# EAGLE design mainboard (EAGLE 9.6.2)
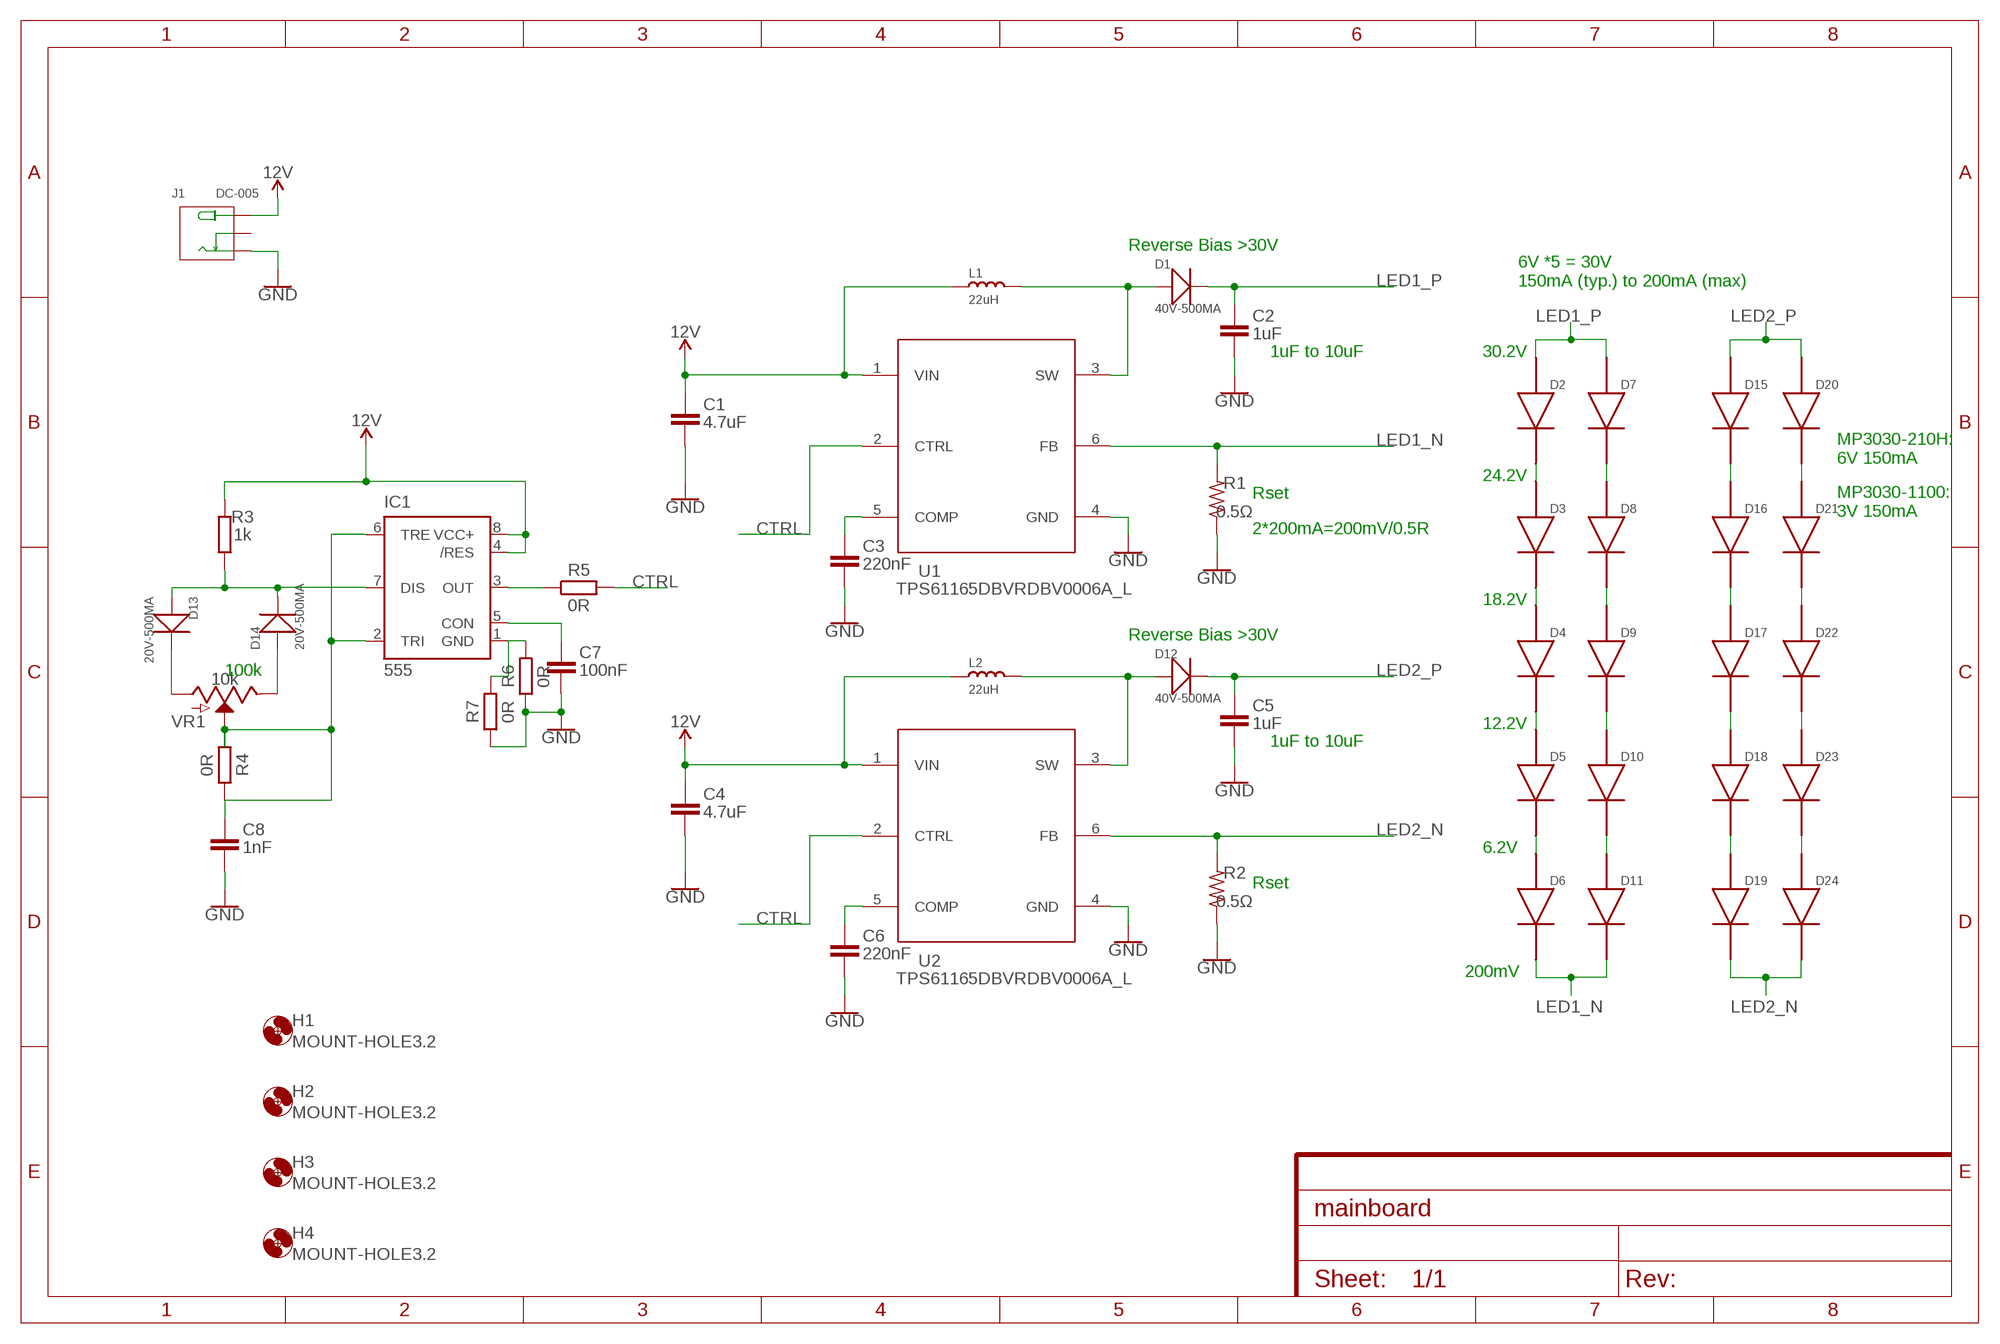
[diagram p0: schematic, sheet 1]

## Parts
C1  4.7uF  C_CHIP-0805(2012-METRIC)  [CAPC2012X110]
C2  1uF  C_CHIP-0805(2012-METRIC)  [CAPC2012X110]
C3  220nF  C_CHIP-0603(1608-METRIC)  [CAPC1608X85]
C4  4.7uF  C_CHIP-0805(2012-METRIC)  [CAPC2012X110]
C5  1uF  C_CHIP-0805(2012-METRIC)  [CAPC2012X110]
C6  220nF  C_CHIP-0603(1608-METRIC)  [CAPC1608X85]
C7  100nF  C_CHIP-0603(1608-METRIC)  [CAPC1608X85]
C8  1nF  C_CHIP-0603(1608-METRIC)  [CAPC1608X85]
D1  40V-500MA  SMD-DIODE-SCHOTTKY-40V-500MA(SOD-123)  [SOD-123]
D2  MP3030_N  [MP3030_N]
D3  MP3030_N  [MP3030_N]
D4  MP3030_N  [MP3030_N]
D5  MP3030_N  [MP3030_N]
D6  MP3030_N  [MP3030_N]
D7  MP3030_N  [MP3030_N]
D8  MP3030_N  [MP3030_N]
D9  MP3030_N  [MP3030_N]
D10  MP3030_N  [MP3030_N]
D11  MP3030_N  [MP3030_N]
D12  40V-500MA  SMD-DIODE-SCHOTTKY-40V-500MA(SOD-123)  [SOD-123]
D13  20V-500MA  SMD-DIODE-SCHOTTKY-20V-500MA(SOD-123)  [SOD-123]
D14  20V-500MA  SMD-DIODE-SCHOTTKY-20V-500MA(SOD-123)  [SOD-123]
D15  MP3030_N  [MP3030_N]
D16  MP3030_N  [MP3030_N]
D17  MP3030_N  [MP3030_N]
D18  MP3030_N  [MP3030_N]
D19  MP3030_N  [MP3030_N]
D20  MP3030_N  [MP3030_N]
D21  MP3030_N  [MP3030_N]
D22  MP3030_N  [MP3030_N]
D23  MP3030_N  [MP3030_N]
D24  MP3030_N  [MP3030_N]
H1  MOUNT-HOLE3.2  [3,2]
H2  MOUNT-HOLE3.2  [3,2]
H3  MOUNT-HOLE3.2  [3,2]
H4  MOUNT-HOLE3.2  [3,2]
IC1  555  555D  [SO08]
J1  DC-005  CONN-POWER-JACK-2.1MM(DC-005)  [DCJ3P-14.2X11.0X9.0MM]
L1  22uH  SMD-INDUCTOR-10UH-20%(2P-6X6MM)'0630'  [SMD-2P-L6.0XW6.0XH3.0MM]
L2  22uH  SMD-INDUCTOR-10UH-20%(2P-6X6MM)'0630'  [SMD-2P-L6.0XW6.0XH3.0MM]
R1  0.5Ω  R-US_CHIP-1206(3216-METRIC)  [RESC3216X70]
R2  0.5Ω  R-US_CHIP-1206(3216-METRIC)  [RESC3216X70]
R3  1k  R_CHIP-0603(1608-METRIC)  [RESC1608X60]
R4  0R  R_CHIP-0603(1608-METRIC)  [RESC1608X60]
R5  0R  R_CHIP-0603(1608-METRIC)  [RESC1608X60]
R6  0R  R_CHIP-1206(3216-METRIC)  [RESC3216X70]
R7  0R  R_CHIP-1206(3216-METRIC)  [RESC3216X70]
U1  TPS61165DBVRDBV0006A_L  [DBV0006A_L]
U2  TPS61165DBVRDBV0006A_L  [DBV0006A_L]
VR1  10k  POTENTIOMETER-PTH-9MM-1/20W-20%  [POT-PTH-ALPS]

## Nets
12V: C1.1 C4.1 IC1.4(/RES) IC1.8(VCC+) J1.+B(+) J1.+T(+) L1.1 L2.1 R3.2 U1.1(VIN) U2.1(VIN)
COMP: C3.1 U1.5(COMP)
COMP1: C6.1 U2.5(COMP)
CON: C7.1 IC1.5(CON)
CTRL: R5.2 U1.2(CTRL) U2.2(CTRL)
DISCHARGE: D13.+ D14.- IC1.7(DIS) R3.1
GND: C1.2 C2.2 C3.2 C4.2 C5.2 C6.2 C7.2 C8.2 IC1.1(GND) J1.-1B(-) J1.-1T(-) R1.1 R2.1 R6.1 R6.2 R7.1 R7.2 U1.4(GND) U2.4(GND)
LED1_N: D6.2 D11.2 R1.2 U1.6(FB)
LED1_P: C2.1 D1.- D2.1 D7.1
LED2_N: D19.2 D24.2 R2.2 U2.6(FB)
LED2_P: C5.1 D12.- D15.1 D20.1
N$1: D17.2 D18.1
N$2: D2.2 D3.1
N$3: D7.2 D8.1
N$4: D3.2 D4.1
N$5: D8.2 D9.1
N$6: D4.2 D5.1
N$7: D9.2 D10.1
N$8: D5.2 D6.1
N$9: D13.- VR1.P$3(A)
N$10: D14.+ VR1.P$1(E)
N$11: D10.2 D11.1
N$12: IC1.3(OUT) R5.1
N$13: D15.2 D16.1
N$15: D16.2 D17.1
N$17: D18.2 D19.1
N$18: D23.2 D24.1
N$19: D22.2 D23.1
N$20: D21.2 D22.1
N$21: D20.2 D21.1
SW: D1.+ L1.2 U1.3(SW)
SW1: D12.+ L2.2 U2.3(SW)
TRIGGER: C8.1 IC1.2(TRI) IC1.6(TRE) R4.1 R4.2 VR1.P$2(S)
Unconnected: J1.-2(CDN) J1.-2B(CDN)

## Notes on the sheet
- Reverse Bias >30V
- 6V *5 = 30V
  150mA (typ.) to 200mA (max)
- 1uF to 10uF | 30.2V
- MP3030-210H:
  6V 150mA
- 24.2V
- Rset
- MP3030-1100:
  3V 150mA
- 2*200mA=200mV/0.5R
- 18.2V
- Reverse Bias >30V
- 100k
- 12.2V
- 1uF to 10uF
- 6.2V
- Rset
- 200mV

## Library data of the parts
C1-C8 = Capacitor:C: Capacitor - Generic; CATEGORY: Capacitor
D1 D12 = OPL_Discrete_Semiconductor:SMD-DIODE-SCHOTTKY-40V-500MA(SOD-123): 304020012; MPN: B0540W
D2-D11 D15-D24 = MP3030:MP3030_N: MP3030 Mid Power LED
D13 D14 = OPL_Discrete_Semiconductor:SMD-DIODE-SCHOTTKY-20V-500MA(SOD-123): 304020032; MPN: SS0520-7-F
H1-H4 = holes:MOUNT-HOLE: MOUNTING HOLE with drill center marker
IC1 = SparkFun-IC-Special-Function:555: General purpose bipolar Timer Datasheet <http://www.sparkfun.com/datasheets/Components/General/ne555.pdf> SparkFun Products SparkFun SparkPunk Sequencer Kit <https://www.sparkfun.com/products/12707> (KIT-12707) Storefront Component: 555 Timer <https://www.sparkfun.com/products/9273> (COM-09273) Two parts valid for production: VFP: IC-11930 (M7555 PTH) VFP: IC-09173 (555 PTH) - Preferred; PROD_ID: NA-XXXXX
J1 = OPL_Connector:CONN-POWER-JACK-2.1MM(DC-005): Seeed SKU 320120003 - DIP Black DC Jack 2.1MM MPN: DC-005 Important Notes: This part requires milling slots. Please make sure layer 46 Milling is included in the profile or outline layer when exporting Gerber files. Alternatively, you can use the built-in Seeed Fusion CAM file. Find it under Third-Party CAM files. Seeed Fusion PCBA OPL <https://www.seeedstudio.com/opl.html> Order PCB/PCBA Now <https://www.seeedstudio.com/fusion_pcb.html> www.seeedstudio.com; MPN: DC-005
L1 L2 = OPL_Inductor:SMD-INDUCTOR-10UH-20%(2P-6X6MM): 303010016; MPN: CSAB0630-100M; VALUE: 10UH
R1 R2 = Resistor:R-US: Resistor Fixed - ANSI; CATEGORY: Resistor; SUB-CATEGORY: Fixed
R3-R7 = Resistor:R: Resistor Fixed - Generic; CATEGORY: Resistor; SUB-CATEGORY: Fixed
U1 U2 = MP3030:TPS61165DBVR; COPYRIGHT: Copyright (C) 2021 Ultra Librarian. All rights reserved.; MANUFACTURER_PART_NUMBER: TPS61165DBVR; MFR_NAME: Texas Instruments; REFDES: RefDes; TYPE: TYPE
VR1 = SparkFun-Resistors:POTENTIOMETER: Potentiometer (Pot) Three-terminal potentiometers, with an adjustable wiper and two adjustable resistors. A pot can be used to create a configurable voltage divider, or as a variable resistor. Variants ALPS_POT and ALPS_POT_KIT - PTH, breadboard compatible, 9mm square pots Rotary Potentiometer - Linear (10k ohm) <https://www.sparkfun.com/products/9288> (COM-09288) The KIT variant exposes copper on only one side of the PTH pad, so the part can only be assembled on one side of the PCB. Useful for beginner soldering kits.; PROD_ID: RES-09177; SF_SKU: COM-09288

## Board
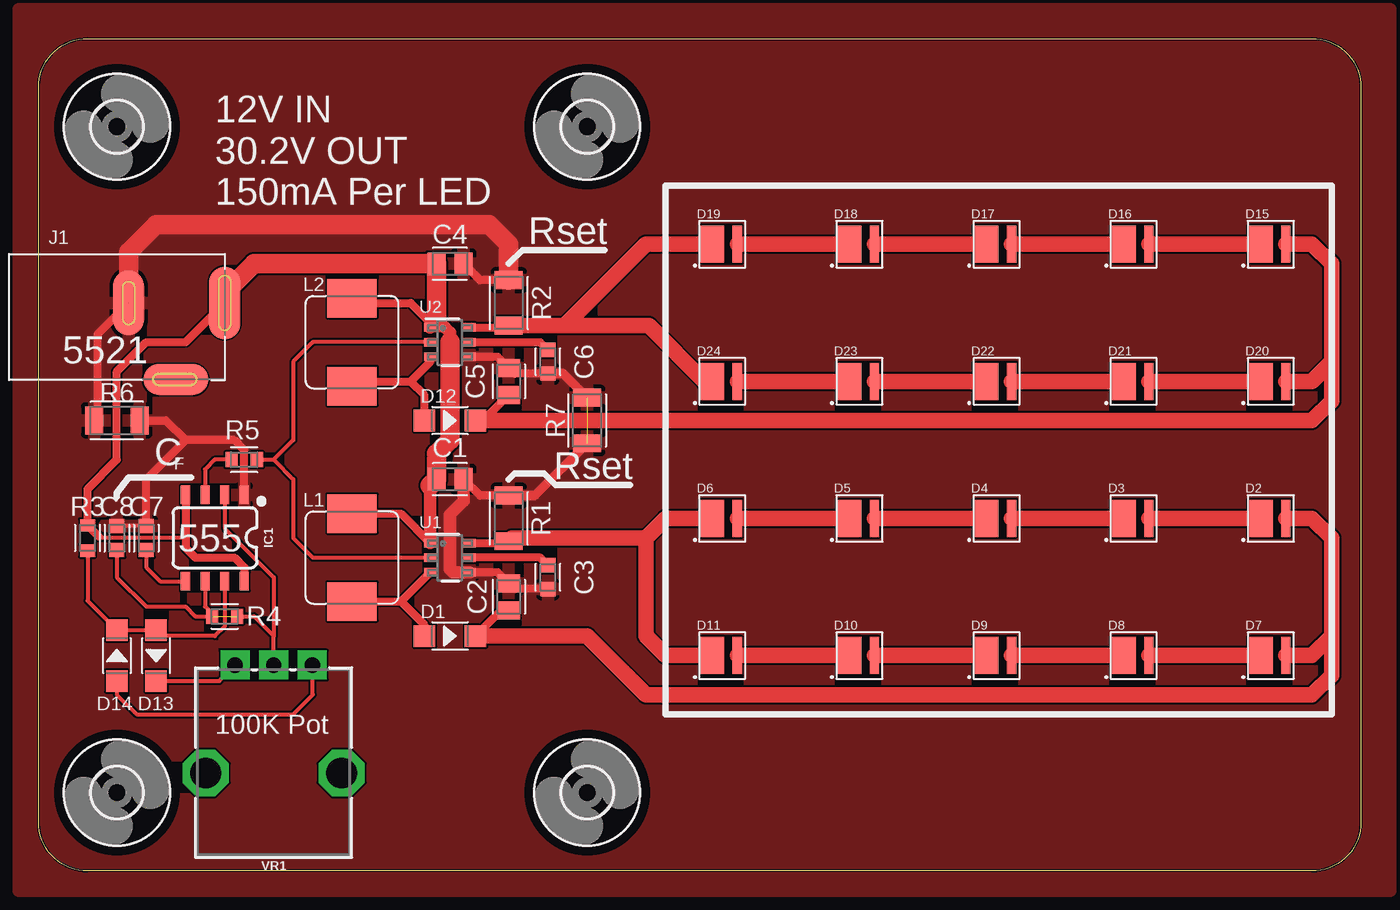
[diagram p1: board, top side]
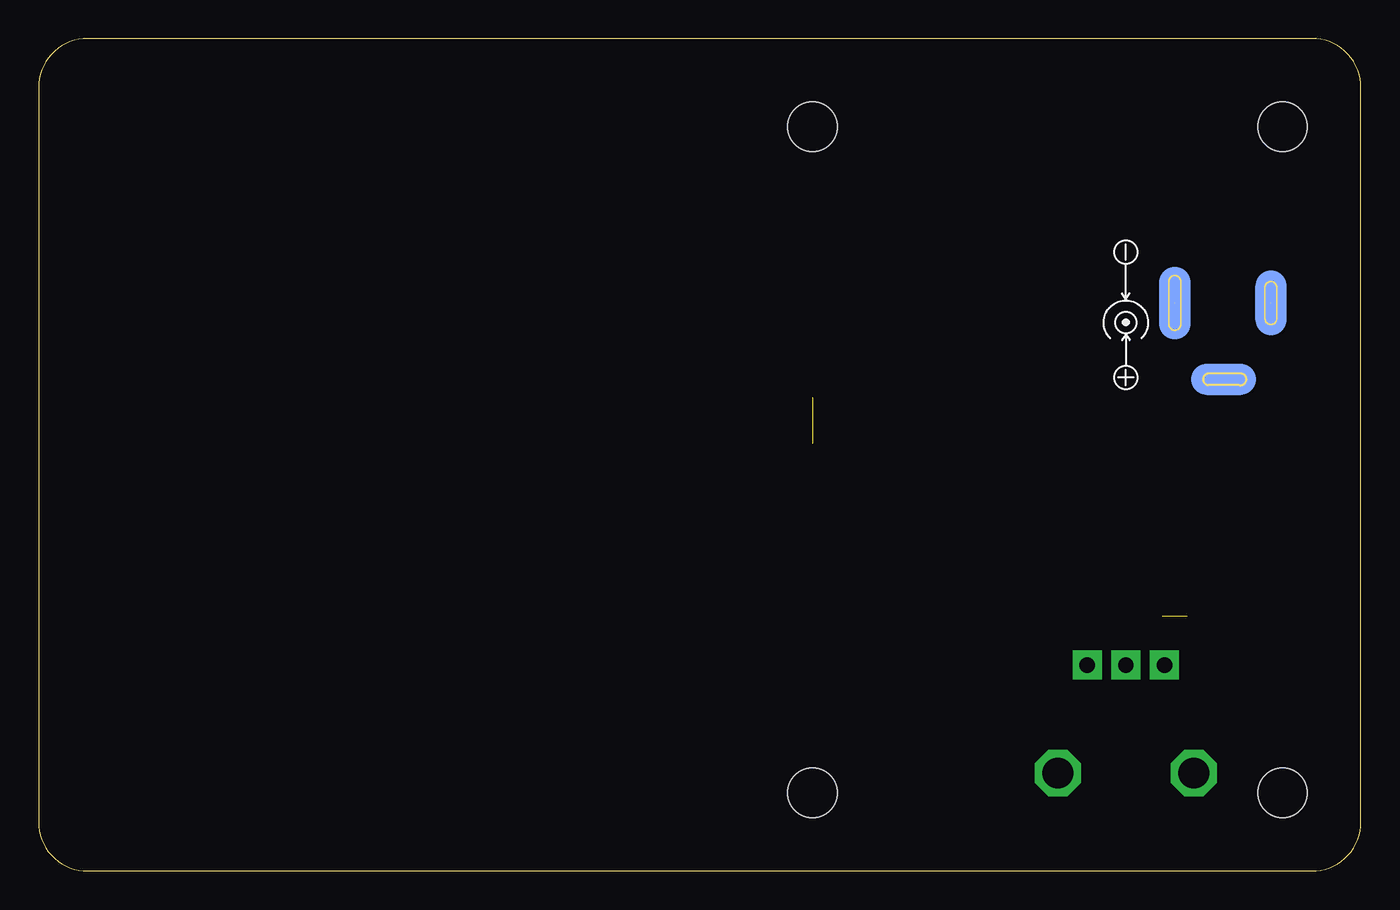
[diagram p2: board, bottom side, seen from below]

Size 85.72 x 53.98 mm. Coordinates in mm from the lower left corner, seen from the top.
Outline: 85.72,50.8 85.72,3.17 arc-90 82.55,0 3.17,0 arc-90 0,3.17 0,50.8 arc-90 3.17,53.98 82.55,53.98 arc-90 85.72,50.8
Copper layers (1*16): Top 0.035559375mm / dielectric 0.17018125mm / Bottom 0.035559375mm
Design rules "jlcpcb-4-layer *": minimum track width 5mil, minimum drill 0.2mm, track to track 0.126490625mm, track to pad 0.126490625mm, pad to pad 0.126490625mm, via to via 0.126490625mm, smd to smd 0mil, copper to edge 0.1mm, drill to drill 5mil, minimum pad ring 4mil, minimum via ring 4mil, stop-mask expansion 3mil, vias tented up to drill 100mil, thermal gap 10mil

### Footprints (pad centres in the part's own frame; a part is rotated, then mirrored left to right if it is on the bottom)
CAPC2012X110 = smd 1.165 x 1.465: 1 -0.875,0; 2 0.875,0
CAPC1608X85 = smd 0.921 x 0.97: 1 -0.775,0; 2 0.775,0
SOD-123 = smd 1.397 x 1.397: + -1.651,0; - 1.651,0
MP3030_N = smd 0.6 x 2.4: 1 0.85,0 | smd 1.6 x 2.4: 2 -0.8,0
3,2 = hole 3.2: 0,0
SO08 = smd 0.6 x 1.2: 1 -1.905,-2.8; 2 -0.635,-2.8; 3 0.635,-2.8; 4 1.905,-2.8; 5 1.905,2.8; 6 0.635,2.8; 7 -0.635,2.8; 8 -1.905,2.8
DCJ3P-14.2X11.0X9.0MM = smd 2 x 4.7 bottom: +B 3.175,0 | smd 2 x 4.7: +T 3.175,0 | smd 2 x 4.2 bottom: -1B -3.048,0 | smd 2 x 4.2: -1T -3.048,0 | smd 4.2 x 2: -2 0,-4.953 | smd 4.2 x 2 bottom: -2B 0,-4.953
SMD-2P-L6.0XW6.0XH3.0MM = smd 2.5 x 3.2: 1 -2.85,0; 2 2.85,0
RESC3216X70 = smd 1.165 x 1.815: 1 -1.475,0; 2 1.475,0
RESC1608X60 = smd 0.799 x 0.974: 1 -0.815,0; 2 0.815,0
DBV0006A_L = smd 0.8 x 0.55: 1 -1.275,0.95; 2 -1.275,0; 3 -1.275,-0.95; 4 1.275,-0.95; 5 1.275,0; 6 1.275,0.95
POT-PTH-ALPS = drill 1 pad 1.88 square: P$1 7,-2.5; P$2 7,0; P$3 7,2.5 | drill 2 octagon: P$4 0,-4.4; P$5 0,4.4

### Placement (x,y rotation side)
C1  26.67,25.4 0 top
C2  30.48,17.78 90 top
C3  33.02,19.05 270 top
C4  26.67,39.37 0 top
C5  30.48,31.75 90 top
C6  33.02,33.02 270 top
C7  6.99,21.59 90 top
C8  5.08,21.59 90 top
D1  26.67,15.24 0 top
D2  80.01,22.86 0 top
D3  71.12,22.86 0 top
D4  62.23,22.86 0 top
D5  53.34,22.86 0 top
D6  44.45,22.86 0 top
D7  80.01,13.97 0 top
D8  71.12,13.97 0 top
D9  62.23,13.97 0 top
D10  53.34,13.97 0 top
D11  44.45,13.97 0 top
D12  26.67,29.21 0 top
D13  7.62,13.97 270 top
D14  5.08,13.97 90 top
D15  80.01,40.64 0 top
D16  71.12,40.64 0 top
D17  62.23,40.64 0 top
D18  53.34,40.64 0 top
D19  44.45,40.64 0 top
D20  80.01,31.75 0 top
D21  71.12,31.75 0 top
D22  62.23,31.75 0 top
D23  53.34,31.75 0 top
D24  44.45,31.75 0 top
H1  5.08,5.08 0 top
H2  35.56,48.26 0 top
H3  35.56,5.08 0 top
H4  5.08,48.26 0 top
IC1  11.43,21.59 180 top
J1  8.89,36.83 0 top
L1  20.32,20.32 270 top
L2  20.32,34.29 270 top
R1  30.48,22.86 270 top
R2  30.48,36.83 270 top
R3  3.17,21.59 90 top
R4  12.06,16.51 180 top
R5  13.34,26.67 0 top
R6  5.08,29.21 0 top
R7  35.56,29.21 90 top
U1  26.67,20.32 0 top
U2  26.67,34.29 0 top
VR1  15.24,6.35 90 top

### Tracks (layer width: path | path; a pad name or v marks a point on that pad's centre or on a via)
12V  (1 unrouted)
  Top 0.254: 3.9,21.68 3.99,21.59 9.53,21.59
  Top 0.508: 3.9,21.68 R3.2 3.17,24.77 5.08,26.67 5.08,32.38 6.99,34.29 9.53,34.29 J1.+T | IC1.4 9.53,21.59 9.53,20.95 10.16,20.32 12.7,20.32 13.34,19.68 IC1.8 | L2.1 20.63,36.83 24.13,36.83 25.39,35.56 U2.1 | L1.1 23.5,23.17 U1.1
  Top 0.61: 25.8,27.07 25.8,26.67 | C4.1 25.39,38.97 | U2.1 26.36,35.24 | 26.67,34.92 26.67,34.29
  Top 0.813: 25.8,35.8 25.8,35.64 U2.1 | 26.67,34.92 26.36,35.24 25.8,35.8 | 25.8,35.8 25.8,35.95 | U1.1 25.39,25
  Top 1.27: J1.+T 12.06,37.47 13.97,39.37 C4.1 25.8,35.95 | 26.67,34.29 26.67,27.94 25.8,27.07 | 25.8,26.67 C1.1 25.39,25
COMP
  Top 0.508: C3.1 32.52,20.32 U1.5
COMP1
  Top 0.508: U2.5 32.52,34.29 C6.1
CON
  Top 0.254: C7.1 6.99,19.68 7.88,18.79 IC1.5
CTRL
  Top 0.254: R5.2 15.24,26.67 | U2.2 17.78,34.29 16.51,33.02 16.51,27.94 15.24,26.67 | 15.24,26.67 16.51,25.4 16.51,21.59 17.78,20.32 U1.2
DISCHARGE
  Top 0.254: R3.1 3.17,17.53 D14.- D13.+ 8,15.24 11.43,15.24 12.06,15.88 IC1.7
GND  (2 unrouted)
  Top 0.254: C7.2 C8.2
  Top 0.508: C7.2 6.99,25.4 9.53,27.94 | J1.-1T 3.81,34.8 3.81,29.66 R6.1 | R6.2 8.26,29.21 9.53,27.94 | IC1.1 13.34,27.3 12.7,27.94 9.53,27.94 | U2.4 29.77,33.34 C5.2 30.86,32.24 C6.2 | R2.1 28.61,38.3 C4.2 | U1.4 29.77,19.37 C2.2 30.86,18.27 C3.2 | R1.1 28.61,24.34 C1.2
  Top 0.61: R7.2 34,32.24 C6.2 | R7.1 32.16,24.34 R1.1
  Top 0.813: U1.4 26.86,19.37 26.67,19.56 26.67,23.11 27.55,23.99 C1.2
  Top 1.27: J1.-1T 5.84,40.13 7.62,41.91 29.21,41.91 30.48,40.64 R2.1
  pour Top: -1.27,55.88 -1.27,-1.27 87.63,-1.27 87.63,55.88
LED1_N
  Top 0.508: U1.6 30.36,21.27 R1.2
  Top 1.016: R1.2 30.68,21.59 39.37,21.59 | 39.37,21.59 40.64,22.86 D6.2 | 39.37,21.59 39.37,15.24 40.64,13.97 D11.2
LED1_P
  Top 0.508: D1.- 29.99,16.91 C2.1
  Top 1.016: D2.1 82.55,22.86 83.82,21.59 83.82,15.24 | 83.82,15.24 82.55,13.97 D7.1 | 83.82,15.24 83.82,12.7 82.55,11.43 39.37,11.43 35.56,15.24 D1.-
LED2_N
  Top 0.508: U2.6 30.36,35.24 R2.2
  Top 1.016: D19.2 39.37,40.64 34.09,35.35 | R2.2 34.09,35.35 | 34.09,35.35 39.58,35.35 43.18,31.75 D24.2
LED2_P
  Top 0.508: C5.1 28.82,29.21 D12.-
  Top 1.016: D15.1 82.55,40.64 83.82,39.37 83.82,33.02 | 83.82,33.02 82.55,31.75 D20.1 | 83.82,33.02 83.82,30.48 82.55,29.21 D12.-
N$1
  Top 1.016: D18.1 D17.2
N$2
  Top 1.016: D3.1 D2.2
N$3
  Top 1.016: D7.2 D8.1
N$4
  Top 1.016: D4.1 D3.2
N$5
  Top 1.016: D8.2 D9.1
N$6
  Top 1.016: D5.1 D4.2
N$7
  Top 1.016: D9.2 D10.1
N$8
  Top 1.016: D6.1 D5.2
N$9
  Top 0.254: D13.- 11.71,12.32 VR1.P$3
N$10
  Top 0.254: D14.+ 5.08,11.43 6.35,10.16 16.51,10.16 17.78,11.43 17.78,13.31 VR1.P$1
N$11
  Top 1.016: D10.2 D11.1
N$12
  Top 0.254: R5.1 11.43,26.67 10.79,26.04 IC1.3
N$13
  Top 1.016: D16.1 D15.2
N$15
  Top 1.016: D17.1 D16.2
N$17
  Top 1.016: D19.1 D18.2
N$18
  Top 1.016: D24.1 D23.2
N$19
  Top 1.016: D23.1 D22.2
N$20
  Top 1.016: D22.1 D21.2
N$21
  Top 1.016: D21.1 D20.2
SW
  Top 0.508: L1.2 23.5,17.47 | 23.5,17.47 U1.3 | 23.5,17.47 25.02,15.95 D1.+
SW1
  Top 0.508: L2.2 20.63,31.75 24.13,31.75 | 24.13,31.75 25.39,33.02 U2.3 | D12.+ 25.02,30.86 24.13,31.75
TRIGGER  (1 unrouted)
  Top 0.254: R4.1 13.97,16.51 15.24,15.24 | VR1.P$2 15.24,15.24 | IC1.6 10.79,17.14 11.43,16.51 R4.2 10.16,16.51 9.53,17.14 6.99,17.14 5.08,19.05 C8.1 | IC1.2 12.06,22.23 15.24,19.05 15.24,15.24

### Text on the board
tNames: 12V IN / 30.2V OUT / 150mA Per LED | Rset | 5521 | C | F | Rset | 555 | 100K Pot